# Altium project SelfBalancingRobot.PrjPcb
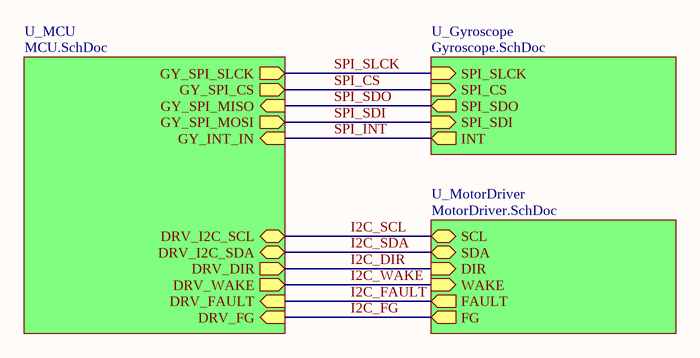
[diagram p0: MainPCB.SchDoc]
4 sheets, 43 parts. Net scope: hierarchical (ports join the sheet entries above them; power ports are global).
Board file: MainPCB.PcbDoc
Sheets:
  MainPCB.SchDoc
    U_Gyroscope = Gyroscope.SchDoc
    U_MotorDriver = MotorDriver.SchDoc
    U_MCU = MCU.SchDoc

## Sheet MainPCB.SchDoc
size A4; SheetNumber: 1; SheetTotal: 4

### Sub-sheets
U_Gyroscope = Gyroscope.SchDoc: SPI_SDI (in), SPI_SLCK (in), SPI_CS (in), SPI_SDO (out), INT (out)
U_MCU = MCU.SchDoc: GY_SPI_CS (out), GY_SPI_MISO (in), GY_SPI_MOSI (out), GY_SPI_SLCK (out), GY_INT_IN (in), DRV_I2C_SCL (bidir), DRV_I2C_SDA (bidir), DRV_WAKE (out), DRV_FAULT (in), DRV_DIR (out), DRV_FG (in)
U_MotorDriver = MotorDriver.SchDoc: SCL (bidir), SDA (bidir), DIR (in), FG (out), WAKE (in), FAULT (out)

### Nets
I2C_DIR: sheet U_MotorDriver/DIR, sheet U_MCU/DRV_DIR
I2C_FAULT: sheet U_MotorDriver/FAULT, sheet U_MCU/DRV_FAULT
I2C_FG: sheet U_MotorDriver/FG, sheet U_MCU/DRV_FG
I2C_SCL: sheet U_MotorDriver/SCL, sheet U_MCU/DRV_I2C_SCL
I2C_SDA: sheet U_MotorDriver/SDA, sheet U_MCU/DRV_I2C_SDA
I2C_WAKE: sheet U_MotorDriver/WAKE, sheet U_MCU/DRV_WAKE
SPI_CS: sheet U_Gyroscope/SPI_CS, sheet U_MCU/GY_SPI_CS
SPI_INT: sheet U_Gyroscope/INT, sheet U_MCU/GY_INT_IN
SPI_SDI: sheet U_Gyroscope/SPI_SDI, sheet U_MCU/GY_SPI_MOSI
SPI_SDO: sheet U_Gyroscope/SPI_SDO, sheet U_MCU/GY_SPI_MISO
SPI_SLCK: sheet U_Gyroscope/SPI_SLCK, sheet U_MCU/GY_SPI_SLCK

## Sheet Gyroscope.SchDoc
size A4; SheetNumber: 3; SheetTotal: 4
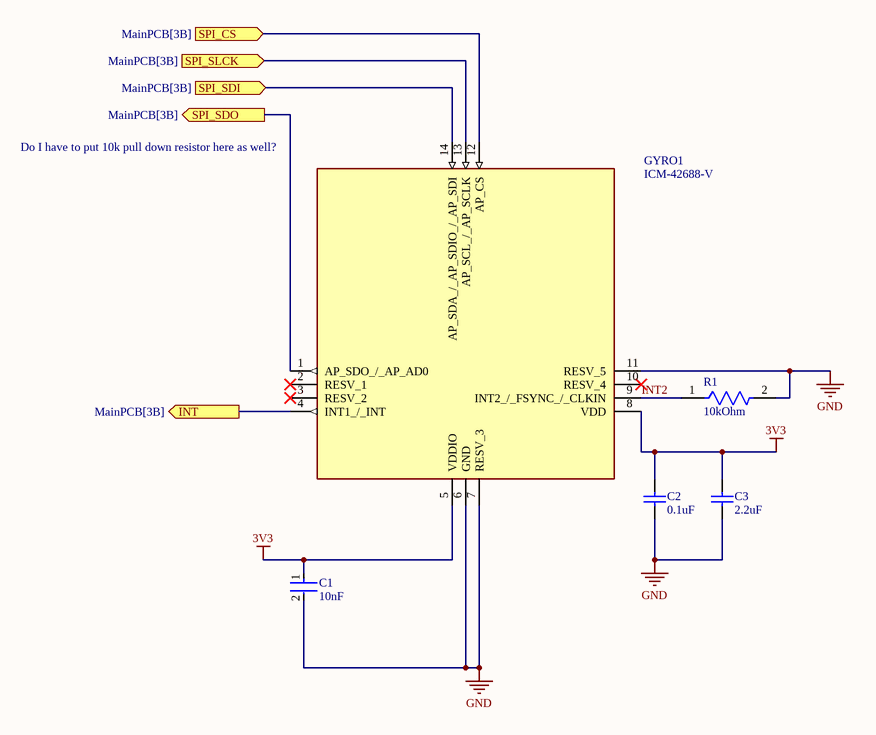
[diagram p1: Gyroscope.SchDoc]

### Parts
C1  10nF  [FP-0402-L_1_0_1-W_0_5_0_1-IPC_C]
C2  0.1uF  [CAPC1005X56X25LL10T15]
C3  2.2uF  [CAPC0603(1608)100_L]
GYRO1  ICM-42688-V  [IIM42352]
R1  10kOhm  [FP-RT0402-MFG]

### Ports
INT (out, see MainPCB[3B]), SPI_CS (in, see MainPCB[3B]), SPI_SDI (in, see MainPCB[3B]), SPI_SDO (out, see MainPCB[3B]), SPI_SLCK (in, see MainPCB[3B])

### Nets
3V3: C1.1 C2.2 C3.1 GYRO1.5(VDDIO) GYRO1.8(VDD)
GND: C1.2 C2.1 C3.2 GYRO1.6(GND) GYRO1.7(RESV_3) GYRO1.11(RESV_5) R1.2
INT2: GYRO1.9(INT2_/_FSYNC_/_CLKIN) R1.1  [project net INT2_3]
SPI_CS: GYRO1.12(AP_CS) ; port SPI_CS
SPI_INT: GYRO1.4(INT1_/_INT) ; port INT
SPI_SDI: GYRO1.14(AP_SDA_/_AP_SDIO_/_AP_SDI) ; port SPI_SDI
SPI_SDO: GYRO1.1(AP_SDO_/_AP_AD0) ; port SPI_SDO
SPI_SLCK: GYRO1.13(AP_SCL_/_AP_SCLK) ; port SPI_SLCK

Not connected (* = marked no-connect by the designer): GYRO1 2(RESV_1)* 3(RESV_2)* 10(RESV_4)*

### Notes on the sheet
- (near GYRO1) Do I have to put 10k pull down resistor here as well?

### Library data of the parts
C1 = CMP-2008-02516-2: 04023C103KAT2A; Tolerance: 10%; Dielectric: X7R; Voltage: 25V; Dissipation Factor: 12.5%; Insulation Resistance: 100GR; Case Code (Imperial): 0402; Mount: Surface Mount; Package Quantity: 1; Capacitance: 10nF; Lead Free: Lead Free; Series: -; Case Code (Metric): 1005; Termination: SMD/SMT; Voltage Rating (DC): 25V; Case/Package: 0402; Width: 0.02inch; Min Operating Temperature: -55°C; RoHS Compliant: Yes; Height: 0.56mm; Radiation Hardening: No; Depth: 0.5mm; Construction: Flat; Max Operating Temperature: 125°C; Length: 1mm; Voltage Rating: 25V; REACH SVHC: No SVHC; Thickness: 0.022inch; Packaging: Tape and Reel
C2 = CMP-2008-02972-1: 04023C104JAT2A; Manufacturer: AVX Interconnect / Elco; Part Number: 04023C104JAT2A
C3 = CMP-1035-02758-1: C0603C225K8PAC; Rated Voltage: 10 V; Case-EIA: 0603; Case-Metric: 1608; Tolerance: Â±10%; Value: 2.2uF; Max Thickness: 1 mm; Technology: SMT
GYRO1 = ICM-42688-V: Accelerometer; Manufacturer_Name: TDK; Datasheet Link: https://3cfeqx1hf82y3xcoull08ihx-wpengine.netdna-ssl.com/wp-content/uploads/2021/04/DS-000439-ICM-42688-V-v1.1.pdf; Manufacturer_Part_Number: ICM-42688-V; Mouser Part Number: 410-ICM-42688-V; Mouser Price/Stock: https://www.mouser.co.uk/ProductDetail/TDK-InvenSense/ICM-42688-V?qs=iLbezkQI%252Bsj8X%2F1CCh43jQ%3D%3D
R1 = CMP-2002-03023-2: RT0402FRE0710KL; Manufacturer: Yageo; Resistance: 10KΩ; Temperature Coefficient: 50 ppm/°C; Power Rating: 0.063W; Voltage Rating: 50V; Tolerance: 0.01; Value: 10KΩ; Height: 0.35mm; Category: Res; Automotive: No; Manufacturer Part Number: RT0402FRE0710KL; Temperature Range Low: -55°C; Mouser Description: Thin Film Resistors - SMD 1/16W 10K ohm 1% 50ppm; Series: RT; ComponentLink2URL: http://www.yageo.com/documents/recent/PYu-RT_1-to-0.01_RoHS_L_9.pdf; Composition: Thin Film; Ipc Land Pattern Name: RESC10050X30; ComponentLink2Description: Datasheet; Device Class L2: Resistors; Lead Free: Yes; Digikey Description: RES 10.0K OHM 1/16W 1% SMD 0402; Footprint Url: http://www.yageo.com/exep/pages/download/literatures/PYu-R_Mount_10.pdf; RoHS: TRUE; Octopart: https://octopart.com/rt0402fre0710kl-yageo-1293756; Package: RT0402; Device Class L1: Passive Components; Temperature: -55°C to +155°C; Device Class L3: Chip SMD Resistors; Temperature Range High: +155°C

## Sheet MotorDriver.SchDoc
size A4; SheetNumber: 4; SheetTotal: 4
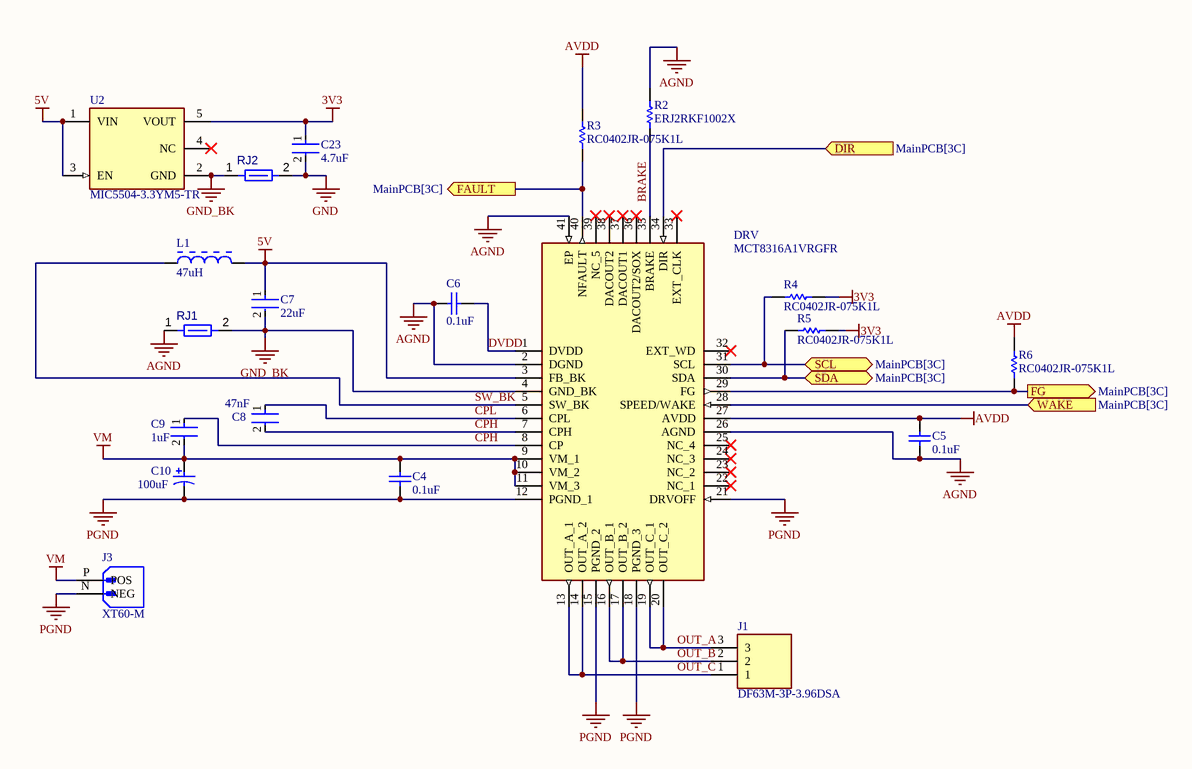
[diagram p2: MotorDriver.SchDoc]

### Parts
C4  0.1uF  [CAPC1005X56X25LL10T15]
C5  0.1uF  [CAPC1005X56X25LL10T15]
C6  0.1uF  [CAPC1005X56X25LL10T15]
C7  22uF  [FP-1206-L_3_2_0_2-W_1_6_0-IPC_C]
C8  47nF  [FP-CC0402-MFG]
C9  1uF  [FP-C1005-050-0_05-IPC_C]
C10  100uF  [PNSC-FK-V-D8_V]
C23  4.7uF  [FP-C1005-050-0_15-MFG]
DRV  MCT8316A1VRGFR  [QFN50P500X700X100-41N-D]
J1  DF63M-3P-3.96DSA  [DF63M3P396DSA]
J3  XT60-M  [AMASS_XT60-M]
L1  47uH  [BOUR-SRN3015-2_V]
R2  ERJ2RKF1002X  [RESC1005X40X25LL05T05]
R3  RC0402JR-075K1L  [RESC1005X40X25ML05T10]
R4  RC0402JR-075K1L  [RESC1005X40X25ML05T10]
R5  RC0402JR-075K1L  [RESC1005X40X25ML05T10]
R6  RC0402JR-075K1L  [RESC1005X40X25ML05T10]
RJ1  Net Tie 10x8mil  [New footprint 1]  (value not drawn)  (net tie, no BOM)
RJ2  Net Tie 10x8mil  [New footprint 1]  (value not drawn)  (net tie, no BOM)
U2  MIC5504-3.3YM5-TR  [FP-SOT23-5LD-PL-1-MFG]

### Ports
DIR (in, see MainPCB[3C]), FAULT (out, see MainPCB[3C]), FG (out, see MainPCB[3C]), SCL (bidir, see MainPCB[3C]), SDA (bidir, see MainPCB[3C]), WAKE (in, see MainPCB[3C])

### Nets
3V3: C23.1 R4.2 R5.2 U2.5(VOUT)
5V: C7.1 DRV.3(FB_BK) L1.2 U2.1(VIN) U2.3(EN)
AGND: C5.1 C6.1 DRV.2(DGND) DRV.26(AGND) DRV.41(EP) R2.2 RJ1.1
AVDD: C5.2 DRV.27(AVDD) R3.1 R6.2
GND: C23.2 RJ2.2
GND_BK: C7.2 DRV.4(GND_BK) RJ1.2 RJ2.1 U2.2(GND)
PGND: C4.1 C10.2 DRV.12(PGND_1) DRV.15(PGND_2) DRV.18(PGND_3) DRV.21(DRVOFF) J3.N(NEG)
VM: C4.2 C9.2 C10.1 DRV.9(VM_1) DRV.10(VM_2) DRV.11(VM_3) J3.P(POS)
BRAKE: DRV.35(BRAKE) R2.1  [project net BRAKE_4]
CPH: C8.2 C9.1 DRV.7(CPH) DRV.8(CP)  [project net CPH_4]
CPL: C8.1 DRV.6(CPL)  [project net CPL_4]
DVDD: C6.2 DRV.1(DVDD)  [project net DVDD_4]
I2C_DIR: DRV.34(DIR) ; port DIR
I2C_FAULT: DRV.40(NFAULT) R3.2 ; port FAULT
I2C_FG: DRV.29(FG) R6.1 ; port FG
I2C_SCL: DRV.31(SCL) R4.1 ; port SCL
I2C_SDA: DRV.30(SDA) R5.1 ; port SDA
I2C_WAKE: DRV.28(SPEED/WAKE) ; port WAKE
OUT_A: DRV.19(OUT_C_1) DRV.20(OUT_C_2) J1.3  [project net OUT_A_4]
OUT_B: DRV.16(OUT_B_1) DRV.17(OUT_B_2) J1.2  [project net OUT_B_4]
OUT_C: DRV.13(OUT_A_1) DRV.14(OUT_A_2) J1.1  [project net OUT_C_4]
SW_BK: DRV.5(SW_BK) L1.1  [project net SW_BK_4]

Not connected (* = marked no-connect by the designer): DRV 22(NC_1)* 23(NC_2)* 24(NC_3)* 25(NC_4)* 32(EXT_WD)* 33(EXT_CLK)* 36(DACOUT2/SOX)* 37(DACOUT1)* 38(DACOUT2)* 39(NC_5)*; U2 4(NC)*

### Library data of the parts
C4-C6 = CMP-2008-02972-1: as C2 on sheet Gyroscope; Part Number: 04023C104JAT2A
C7 = CMP-2000-05869-2: 12066D226MAT2A; Tolerance: 20%; Voltage Rating: 6.3V; Dielectric: X5R; Lead Free: Lead Free; Case Code (Metric): 3216; Case/Package: 1206; Depth: 1.6mm; Capacitance: 22uF; Length: 3.2mm; Series: -; Contact Plating: Tin; REACH SVHC: No SVHC; Radiation Hardening: No; RoHS Compliant: Yes; Termination: SMD/SMT; Packaging: Tape and Reel; Voltage: 6.3V; Mount: Surface Mount; Thickness: 0.07inch; Package Quantity: 1; Voltage Rating (DC): 6.3V; Case Code (Imperial): 1206; Construction: Flat; Number of Pins: 2; Min Operating Temperature: -55°C; Height: 0.07mm; Width: 0.063inch; Max Operating Temperature: 85°C
C8 = CMP-03422-000813-1: CC0402KRX7R8BB473; Manufacturer: YAGEO; Automotive Grade: NA; Voltage Rating: 25 V; Temperature Coefficient: 30ppm/°C; Temperature Characteristic: X7R; Material: Ceramic; Tolerance: 0.1; Temperature: -55°C to +125°C; Category: Cap; Manufacturer Part Number: CC0402KRX7R8BB473; Digikey Description: CAP CER 0.047UF 25V X7R 0402; Device Class L1: Passive Components; Device Class L3: Ceramic Capacitors; Ipc Land Pattern Name: CAPC10050X50; Value: 47 nF; Temperature Range High: +125°C; ComponentLink2URL: http://www.yageo.com/documents/recent/UPY-GP_NP0_16V-to-50V_16.pdf; Automotive: No; Temperature Range Low: -55°C; Package: CC0402; RoHS: TRUE; Height: 0.55mm; Device Class L2: Capacitors; Capacitance: 47 nF; Octopart: https://octopart.com/cc0402krx7r8bb473-yageo-22850998; Lead Free: Yes; Mouser Description: Multilayer Ceramic Capacitors MLCC - SMD/SMT 47nF 25V X7R 10%; Footprint Url: http://www.yageo.com/exep/pages/download/literatures/UPY-C_GEN_24.pdf; ComponentLink2Description: Datasheet
C9 = CMP-2000-06004-2: C1005X5R1V105K050BC; Voltage Rating (DC): 35V; Dielectric Material: Ceramic; Dielectric: X5R; Tolerance: 10%; Series: C; Capacitance: 1uF; Max Operating Temperature: 85°C; Resistor Type: Ceramic; REACH SVHC: No SVHC; Package Quantity: 1; Packaging: Tape and Reel; Termination: SMD/SMT; Height: 0.5mm; Length: 1mm; Min Operating Temperature: -55°C; Thickness: 0.022inch; Lead Free: Lead Free; Voltage Rating: 35V; Width: 0.02inch; Depth: 0.5mm; Case Code (Imperial): 0402; Case/Package: 0402; Weight: 2.3E-05oz; Radiation Hardening: No; RoHS Compliant: Yes; Case Code (Metric): 1005; Mount: Surface Mount
C10 = CMP-2000-06206-1: EEEFK1E101XP; Manufacturer: Panasonic; Type: Can; Lifetime@Temperature: 2000Hrs@105°C; Capacitance: 100µF; Rated Voltage: 25V; Ripple Current: 280mA; Impedance: 0.34O; Case Size/Dimension: Ø6.3x7.7mm; Operating Temp-Max: 105°C; Series: FK; Package URL: http://industrial.panasonic.com/cdbs/www-data/pdf/RDE0000/DME0000COL48.pdf; Mounting Technology: SurfaceMount; Package Description: 2-Pin Electrolytic Aluminum Capacitor, Body 6.6 x 6.6 mm; Datasheet Version: 03/2016; Datasheet URL: http://industrial.panasonic.com/cdbs/www-data/pdf/RDE0000/ABA0000C1181.pdf; Manufacturer URL: http://www.panasonic.com/; Package Reference: FK-V-D8; Operating Temp Range: -55to+105°C
C23 = CMP-2000-05997-2: CAP CER 4.7UF 10V X5R 0402 C1005X5R1A475K050BC; Dielectric Material: Ceramic; Tolerance: 10%; Series: C; Package Quantity: 10000; Max Operating Temperature: 85°C; Case Code (Imperial): 0402; Lead Free: Lead Free; Voltage Rating (DC): 10V; Packaging: Cut Tape; Voltage Rating: 10V; Min Operating Temperature: -55°C; Dielectric: X5R; Thickness: 0.022inch; Width: 0.02inch; Case/Package: 0402; Case Code (Metric): 1005; Capacitance: 4.7uF; Length: 0.039inch; RoHS Compliant: Yes; REACH SVHC: No SVHC; Mount: Surface Mount
DRV = MCT8316A1VRGFR: Integrated Circuit; Manufacturer_Name: Texas Instruments; Datasheet Link: https://www.ti.com/lit/gpn/mct8316a; Height: 1mm; Manufacturer_Part_Number: MCT8316A1VRGFR; Mouser Part Number: 595-MCT8316A1VRGFR; Mouser Price/Stock: https://www.mouser.co.uk/ProductDetail/Texas-Instruments/MCT8316A1VRGFR?qs=rSMjJ%252B1ewcSMvl4Q8e7VVQ%3D%3D; Arrow Part Number: MCT8316A1VRGFR; Arrow Price/Stock: https://www.arrow.com/en/products/mct8316a1vrgfr/texas-instruments?region=nac
J1 = DF63M-3P-3.96DSA: Connector; Manufacturer_Name: Hirose; Datasheet Link: https://componentsearchengine.com/Datasheets/1/DF63M-3P-3.96DSA.pdf; Height: 10mm; Manufacturer_Part_Number: DF63M-3P-3.96DSA; Mouser Part Number: 798-DF63M-3P-3.96DSA; Mouser Price/Stock: https://www.mouser.co.uk/ProductDetail/Hirose-Connector/DF63M-3P-3.96DSA?qs=T3oQrply3y%2FuoC7pM2eZEQ%3D%3D
J3 = XT60-M: Plug; DC supply; XT60; male; PIN: 2; for cable; soldered; 30A; 500V; MF: AMASS; Price: None; Availability: Not in stock; Package: Package; MP: XT60-M; Value: *; SnapEDA_Link: https://www.snapeda.com/parts/XT60-M/AMASS/view-part/?ref=snap; Check_prices: https://www.snapeda.com/parts/XT60-M/AMASS/view-part/?ref=eda
L1 = CMP-0007-00006-1: SRN3015-470M; Manufacturer: Bourns; DCR Max: 1.406 Ohm; Packing: Tape and Reel; Isat: 0.38 A; Rated current: 0.4 A; Inductance tolerance: +/- 20%; SRF Min: 18 MHz; Resistance to Solder Heat: +260 degC for 10 sec.; ComponentLink1URL: http://www.bourns.com/; ComponentLink1Description: Manufacturer URL; ComponentLink2Description: Datasheet; PackageDescription: 2-Pin SMD, Body 3 x 3 mm, Height 1.5 mm; Inductance: 47 uH; PackageReference: SRN3015; Mounting Technology: Surface Mount; DatasheetVersion: Aug-11; RoHS: TRUE; ComponentLink3URL: http://www.bourns.com/data/global/pdfs/SRN3015.pdf; PartNumber: SRN3015-470M; ComponentLink2URL: http://www.bourns.com/data/global/pdfs/SRN3015.pdf; Operating Temperature: -40 to 125 degC; ComponentLink3Description: Package Specification
R2 = CMP-2000-07588-1: Chip Resistor, 10 KOhm, +/- 1%, 0.1 W, -55 to 155 degC, 0402 (1005 Metric), RoHS, Tape and Reel; Manufacturer: Panasonic; Power Rating: 100mW; Voltage Rating: 50V; Resistance: 10KOhm; Case\/Package: 0402; Temperature Coefficient: 100ppm\/degreesC; RoHSCompliant: True; Lead Free: LeadFree; Package Quantity: 1; Contact Plating: Tin; Length: 1mm; Radiation Hardening: No; REACH SVHC: NoSVHC; Max Operating Temperature: 155degC; Depth: 0.5mm; Case Code (Imperial): 0402; Military Standard: Not; Package Description: 2-Pin Surface Mount Device, Body 1 x 0.5 mm; Termination: SMD/SMT; Case Code (Metric): 1005; Height: 0.35mm; Packaging: TapeandReel; Voltage Rating (DC): 50V; Package Reference: 402; Number of Pins: 2; Tolerance: 1%; Mounting Technology: SurfaceMount; Width: 0.02inch; Mount: SurfaceMount; Datasheet URL: https://industrial.panasonic.com/cdbs/www-data/pdf/RDA0000/AOA0000C304.pdf; Composition: ThickFilm; Datasheet Version: 02/2017; Manufacturer URL: http://www.panasonic.com/; Max Power Dissipation: 100mW; Number of Terminations: 2; Min Operating Temperature: -55degC
R3-R6 = CMP-2002-08025-1: Manufacturer: Yageo / Phycomp; Part Number: RC0402JR-075K1L
RJ1 RJ2 = CMP-009-00116-2: Min Operating Temperature: -55°C; Pins: 2; Max Operating Temperature: 155°C
U2 = CMP-2000-07604-2: IC REG LINEAR 3.3V 300MA SOT23-5; Quiescent Current: 38uA; Operating Supply Current: 42uA; Max Input Voltage: 5.5V; Min Input Voltage: 2.5V; Output Type: Fixed; Power Supply Rejection Ratio (PSRR): 60dB; Dropout Voltage: 380mV; Accuracy: 3%; Number of Outputs: 1; Nominal Output Voltage: 3.3V; Max Output Current: 300mA; Length: 2.9mm; Mount: Surface Mount; Width: 1.6mm; Packaging: Tape and Reel; Output Current: 300mA; Min Operating Temperature: -40°C; Max Operating Temperature: 125°C; Height: 1.1mm; Case/Package: SOT-23-5; REACH SVHC: No SVHC; Number of Pins: 5; Output Voltage: 3.3V

## Sheet MCU.SchDoc
size A3; SheetNumber: 2; SheetTotal: 4
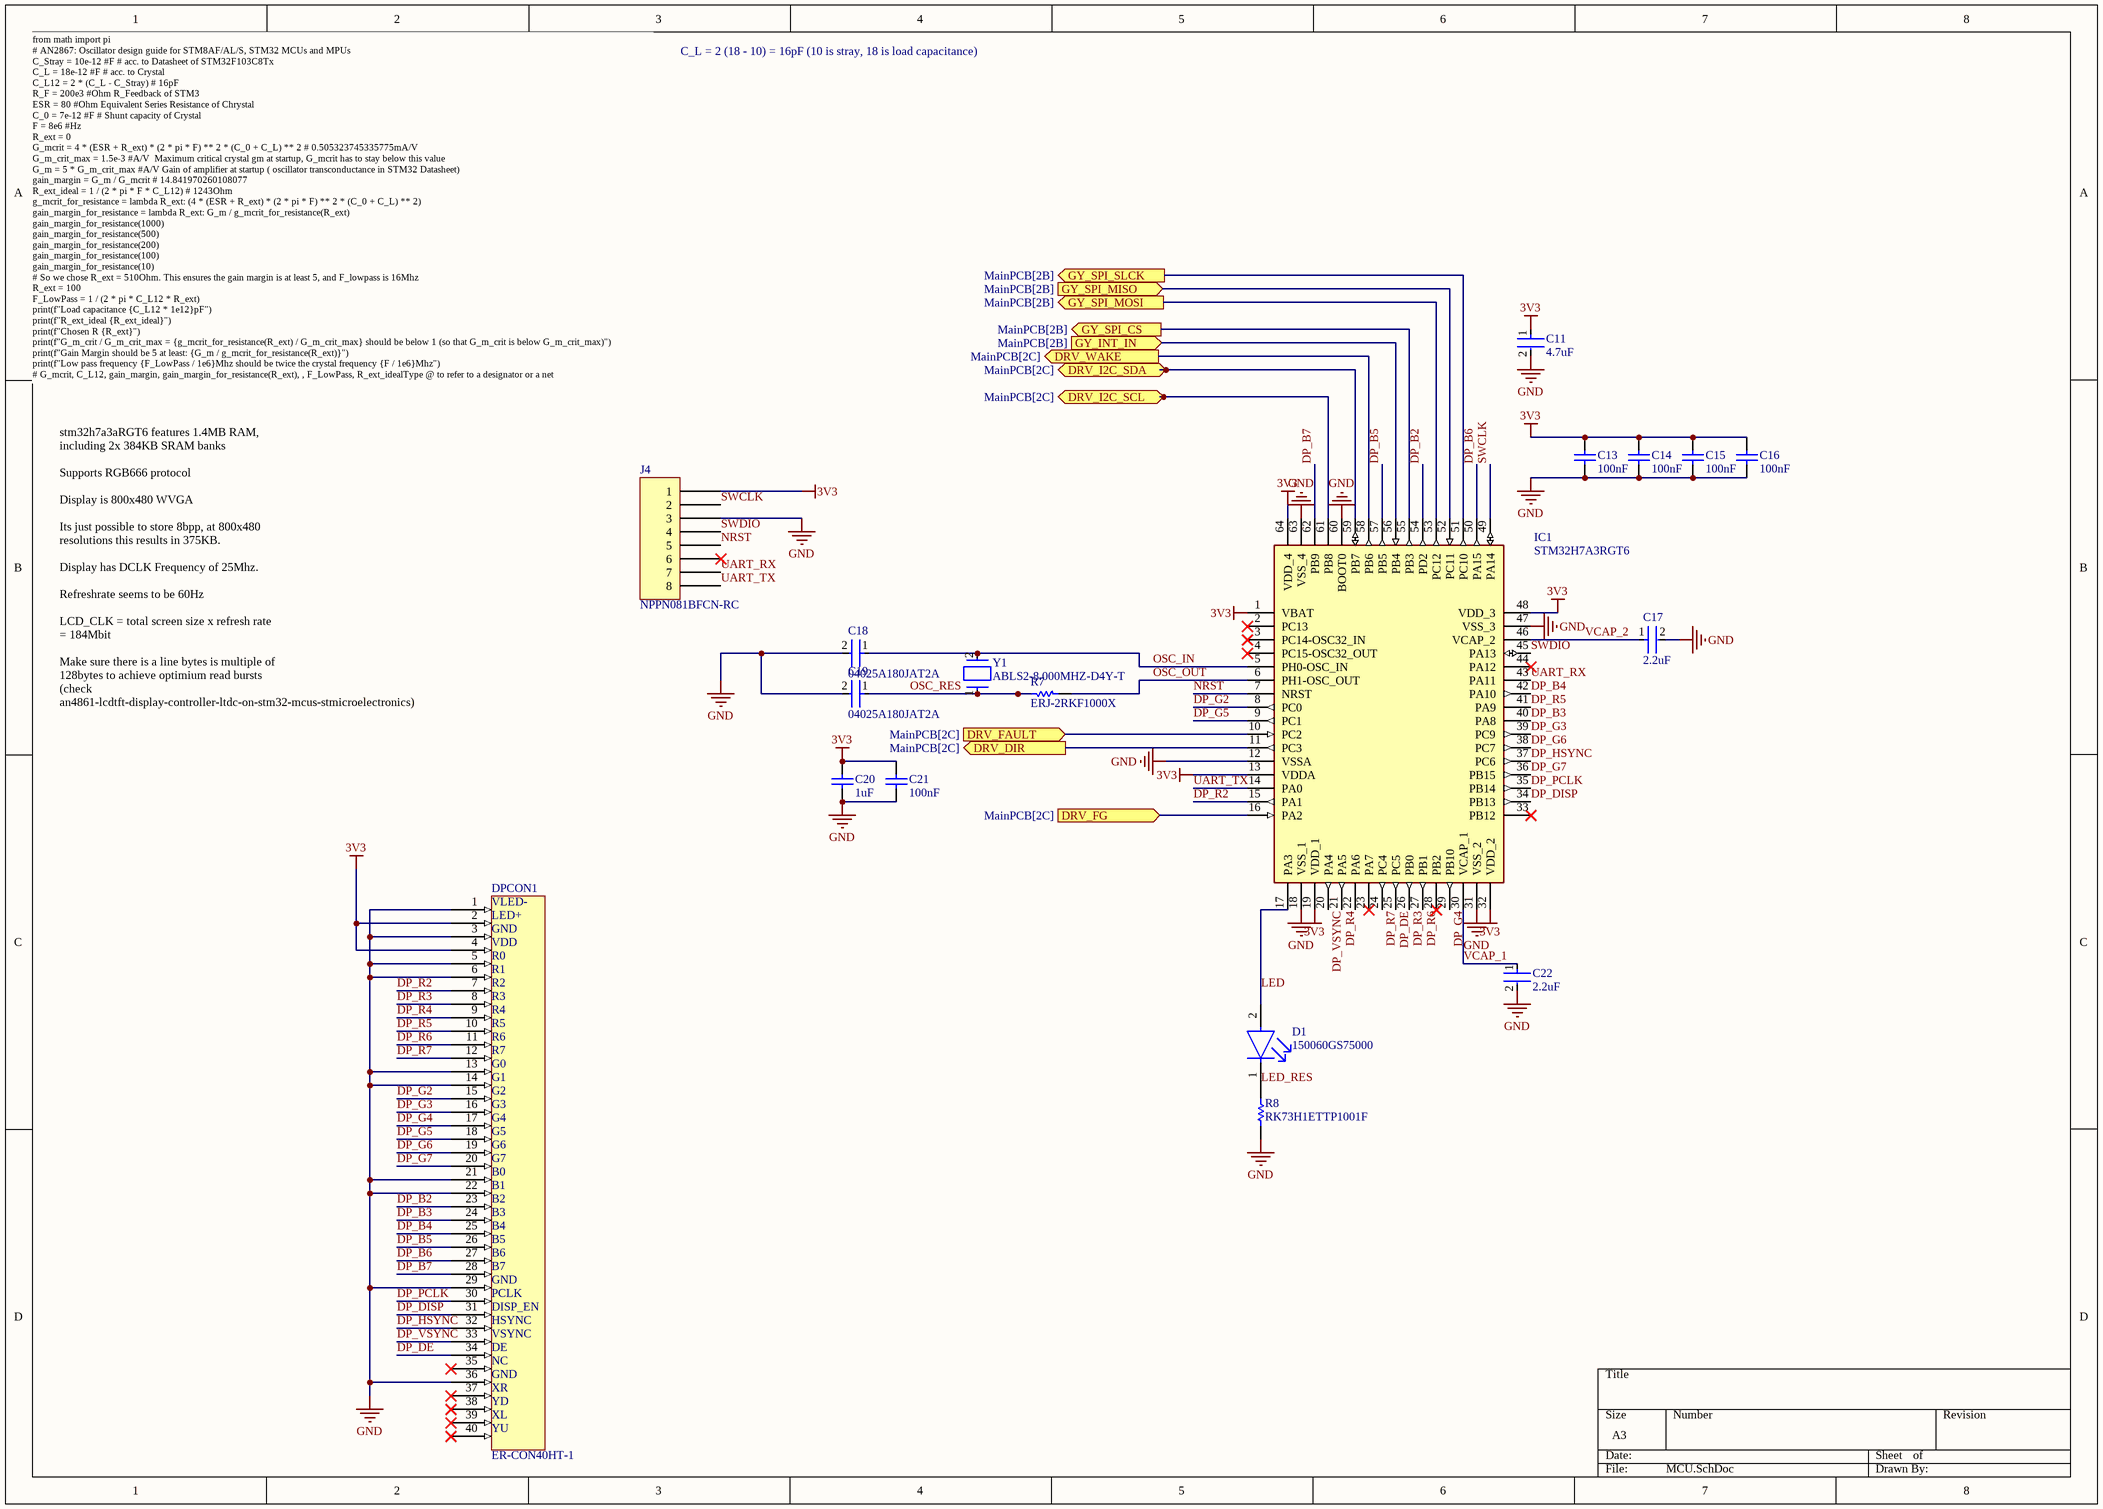
[diagram p3: MCU.SchDoc]

### Parts
C11  4.7uF  [FP-C1005-050-0_15-MFG]
C13  100nF  [CAPC1005X56X25LL10T15]
C14  100nF  [CAPC1005X56X25LL10T15]
C15  100nF  [CAPC1005X56X25LL10T15]
C16  100nF  [CAPC1005X56X25LL10T15]
C17  2.2uF  [FP-C1005-050-0_05-IPC_A]
C18  04025A180JAT2A  [FP-0402-L_1_0_1-W_0_5_0_1-MFG]
C19  04025A180JAT2A  [FP-0402-L_1_0_1-W_0_5_0_1-MFG]
C20  1uF  [CAPC1005X60X30NL05T10]
C21  100nF  [CAPC1005X56X25LL10T15]
C22  2.2uF  [FP-C1005-050-0_05-IPC_A]
D1  150060GS75000  [FP-150060GS75000-MFG]
DPCON1  ER-CON40HT-1  [ER-CON40HT-1]
IC1  STM32H7A3RGT6  [QFP50P1200X1200X160-64N]
J4  NPPN081BFCN-RC  [SULLINS NPPN081BFCN]
R7  ERJ-2RKF1000X  [RESC1005X40X25LL05T05]
R8  RK73H1ETTP1001F  [RESC1005X40X25LL10T10]
Y1  ABLS2-8.000MHZ-D4Y-T  [FP-ABLS2-MFG]

### Ports
DRV_DIR (out, see MainPCB[2C]), DRV_FAULT (in, see MainPCB[2C]), DRV_FG (in, see MainPCB[2C]), DRV_I2C_SCL (bidir, see MainPCB[2C]), DRV_I2C_SDA (bidir, see MainPCB[2C]), DRV_WAKE (out, see MainPCB[2C]), GY_INT_IN (in, see MainPCB[2B]), GY_SPI_CS (out, see MainPCB[2B]), GY_SPI_MISO (in, see MainPCB[2B]), GY_SPI_MOSI (out, see MainPCB[2B]), GY_SPI_SLCK (out, see MainPCB[2B])

### Nets
3V3: C11.1 C13.2 C14.2 C15.2 C16.2 C20.2 C21.2 DPCON1.2 DPCON1.4 IC1.1(VBAT) IC1.13(VDDA) IC1.19(VDD_1) IC1.32(VDD_2) IC1.48(VDD_3) IC1.64(VDD_4) J4.1
GND: C11.2 C13.1 C14.1 C15.1 C16.1 C17.2 C18.2 C19.2 C20.1 C21.1 C22.2 DPCON1.1 DPCON1.3 DPCON1.5 DPCON1.6 DPCON1.13 DPCON1.14 DPCON1.21 DPCON1.22 DPCON1.29 DPCON1.36 IC1.12(VSSA) IC1.18(VSS_1) IC1.31(VSS_2) IC1.47(VSS_3) IC1.60(BOOT0) IC1.63(VSS_4) J4.3 R8.1
DP_B2: DPCON1.23 IC1.54(PD2)  [project net DP_B2_2]
DP_B3: DPCON1.24 IC1.40(PA8)  [project net DP_B3_2]
DP_B4: DPCON1.25 IC1.42(PA10)  [project net DP_B4_2]
DP_B5: DPCON1.26 IC1.57(PB5)  [project net DP_B5_2]
DP_B6: DPCON1.27 IC1.50(PA15)  [project net DP_B6_2]
DP_B7: DPCON1.28 IC1.62(PB9)  [project net DP_B7_2]
DP_DE: DPCON1.34 IC1.25(PC5)  [project net DP_DE_2]
DP_DISP: DPCON1.31 IC1.34(PB13)  [project net DP_DISP_2]
DP_G2: DPCON1.15 IC1.8(PC0)  [project net DP_G2_2]
DP_G3: DPCON1.16 IC1.39(PC9)  [project net DP_G3_2]
DP_G4: DPCON1.17 IC1.29(PB10)  [project net DP_G4_2]
DP_G5: DPCON1.18 IC1.9(PC1)  [project net DP_G5_2]
DP_G6: DPCON1.19 IC1.38(PC7)  [project net DP_G6_2]
DP_G7: DPCON1.20 IC1.36(PB15)  [project net DP_G7_2]
DP_HSYNC: DPCON1.32 IC1.37(PC6)  [project net DP_HSYNC_2]
DP_PCLK: DPCON1.30 IC1.35(PB14)  [project net DP_PCLK_2]
DP_R2: DPCON1.7 IC1.15(PA1)  [project net DP_R2_2]
DP_R3: DPCON1.8 IC1.26(PB0)  [project net DP_R3_2]
DP_R4: DPCON1.9 IC1.21(PA5)  [project net DP_R4_2]
DP_R5: DPCON1.10 IC1.41(PA9)  [project net DP_R5_2]
DP_R6: DPCON1.11 IC1.27(PB1)  [project net DP_R6_2]
DP_R7: DPCON1.12 IC1.24(PC4)  [project net DP_R7_2]
DP_VSYNC: DPCON1.33 IC1.20(PA4)  [project net DP_VSYNC_2]
I2C_DIR: IC1.11(PC3) ; port DRV_DIR
I2C_FAULT: IC1.10(PC2) ; port DRV_FAULT
I2C_FG: IC1.16(PA2) ; port DRV_FG
I2C_SCL: IC1.61(PB8) ; port DRV_I2C_SCL
I2C_SDA: IC1.59(PB7) ; port DRV_I2C_SDA
I2C_WAKE: IC1.58(PB6) ; port DRV_WAKE
LED: D1.2(A) IC1.17(PA3)  [project net LED_2]
LED_RES: D1.1(C) R8.2  [project net LED_RES_2]
NRST: IC1.7(NRST) J4.5  [project net NRST_2]
OSC_IN: C18.1 IC1.5(PH0-OSC_IN) Y1.2  [project net OSC_IN_2]
OSC_OUT: IC1.6(PH1-OSC_OUT) R7.1  [project net OSC_OUT_2]
OSC_RES: C19.1 R7.2 Y1.1  [project net OSC_RES_2]
SPI_CS: IC1.55(PB3) ; port GY_SPI_CS
SPI_INT: IC1.56(PB4) ; port GY_INT_IN
SPI_SDI: IC1.53(PC12) ; port GY_SPI_MOSI
SPI_SDO: IC1.52(PC11) ; port GY_SPI_MISO
SPI_SLCK: IC1.51(PC10) ; port GY_SPI_SLCK
SWCLK: IC1.49(PA14) J4.2  [project net SWCLK_2]
SWDIO: IC1.45(PA13) J4.4  [project net SWDIO_2]
UART_RX: IC1.43(PA11) J4.7  [project net UART_RX_2]
UART_TX: IC1.14(PA0) J4.8  [project net UART_TX_2]
VCAP_1: C22.1 IC1.30(VCAP_1)  [project net VCAP_1_2]
VCAP_2: C17.1 IC1.46(VCAP_2)  [project net VCAP_2_2]

Not connected (* = marked no-connect by the designer): DPCON1 35* 37* 38* 39* 40*; IC1 2(PC13)* 3(PC14-OSC32_IN)* 4(PC15-OSC32_OUT)* 22(PA6) 23(PA7)* 28(PB2)* 33(PB12)* 44(PA12)*; J4 6*

### Notes on the sheet
- C_L = 2 (18 - 10) = 16pF (10 is stray, 18 is load capacitance)
- from math import pi
  # AN2867: Oscillator design guide for STM8AF/AL/S, STM32 MCUs and MPUs
  C_Stray = 10e-12 #F # acc. to Datasheet of STM32F103C8Tx
  C_L = 18e-12 #F # acc. to Crystal
  C_L12 = 2 * (C_L - C_Stray) # 16pF
  R_F = 200e3 #Ohm R_Feedback of STM3
  ESR = 80 #Ohm Equivalent Series Resistance of Chrystal
  C_0 = 7e-12 #F # Shunt capacity of Crystal
  F = 8e6 #Hz
  R_ext = 0
  G_mcrit = 4 * (ESR + R_ext) * (2 * pi * F) ** 2 * (C_0 + C_L) ** 2 # 0.505323745335775mA/V
  G_m_crit_max = 1.5e-3 #A/V  Maximum critical crystal gm at startup, G_mcrit has to stay below this value
  G_m = 5 * G_m_crit_max #A/V Gain of amplifier at startup ( oscillator transconductance in STM32 Datasheet)
  gain_margin = G_m / G_mcrit # 14.841970260108077
  R_ext_ideal = 1 / (2 * pi * F * C_L12) # 1243Ohm
  g_mcrit_for_resistance = lambda R_ext: (4 * (ESR + R_ext) * (2 * pi * F) ** 2 * (C_0 + C_L) ** 2)
  gain_margin_for_resistance = lambda R_ext: G_m / g_mcrit_for_resistance(R_ext)
  gain_margin_for_resistance(1000)
  gain_margin_for_resistance(500)
  gain_margin_for_resistance(200)
  gain_margin_for_resistance(100)
  gain_margin_for_resistance(10)
  # So we chose R_ext = 510Ohm. This ensures the gain margin is at least 5, and F_lowpass is 16Mhz
  R_ext = 100
  F_LowPass = 1 / (2 * pi * C_L12 * R_ext)
  print(f"Load capacitance {C_L12 * 1e12}pF")
  print(f"R_ext_ideal {R_ext_ideal}")
  print(f"Chosen R {R_ext}")
  print(f"G_m_crit / G_m_crit_max = {g_mcrit_for_resistance(R_ext) / G_m_crit_max} should be below 1 (so that G_m_crit is below G_m_crit_max)")
  print(f"Gain Margin should be 5 at least: {G_m / g_mcrit_for_resistance(R_ext)}")
  print(f"Low pass frequency {F_LowPass / 1e6}Mhz should be twice the crystal frequency {F / 1e6}Mhz")
  # G_mcrit, C_L12, gain_margin, gain_margin_for_resistance(R_ext), , F_LowPass, R_ext_idealType @ to refer to a designator or a net
- stm32h7a3aRGT6 features 1.4MB RAM, including 2x 384KB SRAM banks
  Supports RGB666 protocol
  Display is 800x480 WVGA
  Its just possible to store 8bpp, at 800x480 resolutions this results in 375KB.
  Display has DCLK Frequency of 25Mhz.
  Refreshrate seems to be 60Hz
  LCD_CLK = total screen size x refresh rate = 184Mbit
  Make sure there is a line bytes is multiple of 128bytes to achieve optimium read bursts (check an4861-lcdtft-display-controller-ltdc-on-stm32-mcus-stmicroelectronics)
- (in symbol ER-CON40HT-1) VLED-; LED+; GND; VDD; R0; R1; R2; R3; R4; R5; R6; R7; G0; G1; G2; G3; G4; G5; G6; G7; B0; B1; B2; B3; B4; B5; B6; B7; PCLK; DISP_EN; HSYNC; VSYNC; DE; NC; XR; YD; XL; YU

### Library data of the parts
C11 = CMP-2000-05997-2: as C23 on sheet MotorDriver; Series: C; Package Quantity: 10000; Max Operating Temperature: 85°C; Case Code (Imperial): 0402; Lead Free: Lead Free; Voltage Rating (DC): 10V; Packaging: Cut Tape; Voltage Rating: 10V; Min Operating Temperature: -55°C; Dielectric: X5R; Thickness: 0.022inch; Width: 0.02inch; Case/Package: 0402; Case Code (Metric): 1005; Capacitance: 4.7uF; Length: 0.039inch; RoHS Compliant: Yes; REACH SVHC: No SVHC; Mount: Surface Mount
C13-C16 C21 = CMP-2008-02743-1: 04026D104KAT2A; Manufacturer: AVX Interconnect / Elco; Part Number: 04026D104KAT2A
C17 C22 = CMP-08246-002709-1: Multilayer Ceramic Capacitors 2.2μF ±10% 10V X5R SMD 0402 C1005X5R1A225K050BC; Packaging: Tape and Reel; REACH SVHC: No SVHC; Case Code (Imperial): 0402; Voltage Rating: 10V; Radiation Hardening: No; Construction: Flat; Case/Package: 0402; Width: 0.02inch; Length: 1mm; Dielectric Material: Ceramic; Series: C; Height: 0.5mm; Depth: 0.5mm; Thickness: 0.022inch; Tolerance: 10%; Package Quantity: 1; Case Code (Metric): 1005; Min Operating Temperature: -55°C; Dielectric: X5R; Number of Pins: 2; Mount: Surface Mount; Resistor Type: Ceramic; RoHS Compliant: Yes; Weight: 2.3E-05oz; Max Operating Temperature: 85°C; Lead Free: Lead Free; Voltage: 10V; Termination: SMD/SMT; Capacitance: 2.2uF; Voltage Rating (DC): 10V
C18 C19 = CMP-1034-00865-3: General Purpose Ceramic Capacitor, 0402, 18pF, 5%, C0G, 30ppm/°C, 50V; Insulation Resistance: 100GR; Length: 1mm; Voltage Rating (DC): 50V; Dielectric: C0G; Dielectric Material: Ceramic; Thickness: 0.022inch; Max Operating Temperature: 125°C; Min Operating Temperature: -55°C; RoHS Compliant: Yes; Package Quantity: 1; Mount: Surface Mount; Case Code (Imperial): 0402; REACH SVHC: No SVHC; Termination: SMD/SMT; Voltage: 50V; Number of Pins: 2; Contact Plating: Tin; Radiation Hardening: No; Voltage Rating: 50V; Capacitance: 18pF; Case Code (Metric): 1005; Case/Package: 0402; Tolerance: 5%; Packaging: Tape and Reel; Temperature Coefficient: 0ppm/°C; Depth: 0.5mm; Width: 0.02inch; Lead Free: Lead Free; Height: 0.5mm
C20 = CMP-2008-02056-1: C0402C105M8PACTU; Manufacturer: Kemet; Part Number: C0402C105M8PACTU
D1 = CMP-1426-00002-2: LED GREEN CLEAR 0603 SMD; Viewing Angle: 140°; Forward Current: 30mA; Dominant Wavelength: 520nm; Luminous Intensity: 430mcd; Lens Size: 0.7mm; Forward Voltage: 3.2V; Test Current: 20mA; Lens Color: Colorless; Case Code (Imperial): 0603; Case/Package: 0603; Case Code (Metric): 1608; Length: 1.6mm; Lens Style: Clear; Height: 0.8mm; RoHS Compliant: Yes; Package Quantity: 1; Max Operating Temperature: 85°C; Mount: Surface Mount; Wavelength: 520nm; Width: 0.8mm; Lens Transparency: Clear; Packaging: Cut Tape; Color: Green; Lead Free: Lead Free; Min Operating Temperature: -40°C; Series: WL-SMCW
DPCON1 = ER-CON40HT-1: Manufacturer: EastRising
IC1 = STM32H7A3RGT6: Integrated Circuit; Manufacturer_Name: STMicroelectronics; Datasheet Link: https://www.st.com/resource/en/datasheet/stm32h7a3ai.pdf; Height: 1.6mm; Manufacturer_Part_Number: STM32H7A3RGT6; Mouser Part Number: 511-STM32H7A3RGT6; Mouser Price/Stock: https://www.mouser.co.uk/ProductDetail/STMicroelectronics/STM32H7A3RGT6?qs=sPbYRqrBIVk%252BdecRlyVesQ%3D%3D
J4 = NPPN081BFCN-RC: CONN HDR 8POS 0.079 GOLD PCB; Manufacturer: Sullins Connector Solutions; Connector Type: Header; Contact Length - Post: 0.094" (2.40mm); Current Rating (Amps): 2A; Material Flammability Rating: UL94 V-0; Number of Positions: 8; Number of Positions Loaded: All; Pitch - Mating: 0.079" (2.00mm); Style: Board to Board; Part Number: NPPN081BFCN-RC; ComponentLink1Description: Datasheet; ComponentLink1URL: https://drawings-pdf.s3.amazonaws.com/10483.pdf; ComponentLink2Description: DigiKey Link; ComponentLink2URL: https://www.digikey.com/en/products/detail/sullins-connector-solutions/NPPN081BFCN-RC/804810; Contact Finish - Mating: Gold; Contact Finish - Post: Gold; Contact Finish Thickness - Mating: Flash; Contact Type: Female Socket; Fastening Type: Push-Pull; Insulation Color: Black; Insulation Height: 0.173" (4.40mm); LastUpdated: 21.06.2022 14:43:53; Lifecycle Status: Active; Minimum Order: 1; Mounting Type: Through Hole; Number of Rows: 1; Operating Temperature: -40°C ~ 105°C; Packaging: Tube; Part Status: Active; Price: 0.44; Series: -; Supplier 1: DigiKey; Supplier Part Number 1: S5751-08-ND; Termination: Solder
R7 = CMP-2002-00605-3: Chip Resistor, 100 Ohm, +/- 1%, 100 mW, -55 to 155 degC, 0402 (1005 Metric), RoHS, Tape and Reel; Manufacturer: Basic Passives; Power Rating: 100 mW; Resistance: 100 Ohm; Voltage Rating: 50 V; Case\/Package: 0402; Width: 0.5 mm; Pins: 2; ComponentLink2Description: Datasheet; PackageReference: 0402; Height: 0.35 mm; Tolerance: 1%; DatasheetVersion: 04/2015; Case Code (Imperial): 0402; Min Operating Temperature: -55 degC; Radiation Hardening: No; Length: 1 mm; Package Quantity: 10000; PackageDescription: 2-Pin Surface Mount Device, Body 1 x 0.5 mm; Mounting Technology: Surface Mount; Case Code (Metric): 1005; Packaging: Tape and Reel; ComponentLink1URL: http://www.panasonic.com/; RoHSCompliant: true; Max Operating Temperature: 155 degC; REACH SVHC: Yes; PartNumber: ERJ-2RKF1000X; ComponentLink1Description: Manufacturer URL; ComponentLink2URL: http://industrial.panasonic.com/cdbs/www-data/pdf/RDA0000/AOA0000C86.pdf; Mount: Surface Mount
R8 = CMP-2002-03808-1: Manufacturer: KOA Speer; Part Number: RK73H1ETTP1001F
Y1 = CMP-27762-001729-1: CRYSTAL 8.0000MHZ 18PF SMD; Series Resistance: 80R; Tolerance: 30ppm; Frequency: 8MHz; Operating Frequency: 8 MHz; Packaging: Tape and Reel; Number of Pins: 2; Mount: Surface Mount; Package Quantity: 1000; Series: ABLS2; Min Operating Temperature: -40°C; Termination: SMD/SMT; Load Capacitance: 18pF; Lead Free: Lead Free; Frequency Tolerance: 30ppm; RoHS Compliant: Yes; Length: 11.4mm; Width: 4.7mm; Height: 0.13inch; ESR (Equivalent Series Resistance): 80R; Max Operating Temperature: 85°C; Depth: 4.7mm; Frequency Stability: 30ppm

## Nets that join several sheets
3V3: Gyroscope (5 pins), MotorDriver (C23.1 R4.2 R5.2 U2.5), MCU (16 pins)
GND: Gyroscope (7 pins), MotorDriver (C23.2 RJ2.2), MCU (29 pins)
I2C_DIR: MotorDriver (DRV.34), MCU (IC1.11)
I2C_FAULT: MotorDriver (DRV.40 R3.2), MCU (IC1.10)
I2C_FG: MotorDriver (DRV.29 R6.1), MCU (IC1.16)
I2C_SCL: MotorDriver (DRV.31 R4.1), MCU (IC1.61)
I2C_SDA: MotorDriver (DRV.30 R5.1), MCU (IC1.59)
I2C_WAKE: MotorDriver (DRV.28), MCU (IC1.58)
SPI_CS: Gyroscope (GYRO1.12), MCU (IC1.55)
SPI_INT: Gyroscope (GYRO1.4), MCU (IC1.56)
SPI_SDI: Gyroscope (GYRO1.14), MCU (IC1.53)
SPI_SDO: Gyroscope (GYRO1.1), MCU (IC1.52)
SPI_SLCK: Gyroscope (GYRO1.13), MCU (IC1.51)